# Altium schematic sheet Top.SchDoc
size A4; SheetNumber: 1; SheetTotal: 5
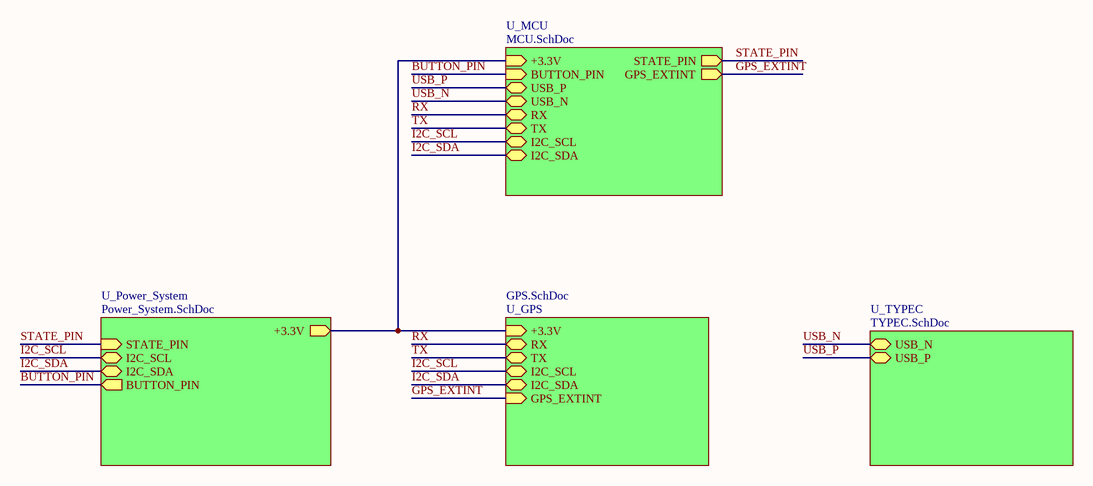
[diagram p0: Top.SchDoc]

## Sub-sheets
U_GPS = GPS.SchDoc: RX (bidir), TX (bidir), I2C_SCL (bidir), I2C_SDA (bidir), +3.3V (in), GPS_EXTINT (in)
U_MCU = MCU.SchDoc: STATE_PIN (out), BUTTON_PIN (in), USB_P (bidir), USB_N (bidir), RX (bidir), TX (bidir), I2C_SCL (bidir), I2C_SDA (bidir), +3.3V (in), GPS_EXTINT (out)
U_Power_System = Power_System.SchDoc: STATE_PIN (in), BUTTON_PIN (out), +3.3V (out), I2C_SCL (bidir), I2C_SDA (bidir)
U_TYPEC = TYPEC.SchDoc: USB_N (bidir), USB_P (bidir)

## Nets
BUTTON_PIN: sheet U_Power_System/BUTTON_PIN, sheet U_MCU/BUTTON_PIN
GPS_EXTINT: sheet U_MCU/GPS_EXTINT, sheet U_GPS/GPS_EXTINT
I2C_SCL: sheet U_Power_System/I2C_SCL, sheet U_MCU/I2C_SCL, sheet U_GPS/I2C_SCL
I2C_SDA: sheet U_Power_System/I2C_SDA, sheet U_MCU/I2C_SDA, sheet U_GPS/I2C_SDA
RX: sheet U_MCU/RX, sheet U_GPS/RX
STATE_PIN: sheet U_Power_System/STATE_PIN, sheet U_MCU/STATE_PIN
TX: sheet U_MCU/TX, sheet U_GPS/TX
USB_N: sheet U_MCU/USB_N, sheet U_TYPEC/USB_N
USB_P: sheet U_MCU/USB_P, sheet U_TYPEC/USB_P
(unnamed): sheet U_Power_System/+3.3V, sheet U_MCU/+3.3V, sheet U_GPS/+3.3V